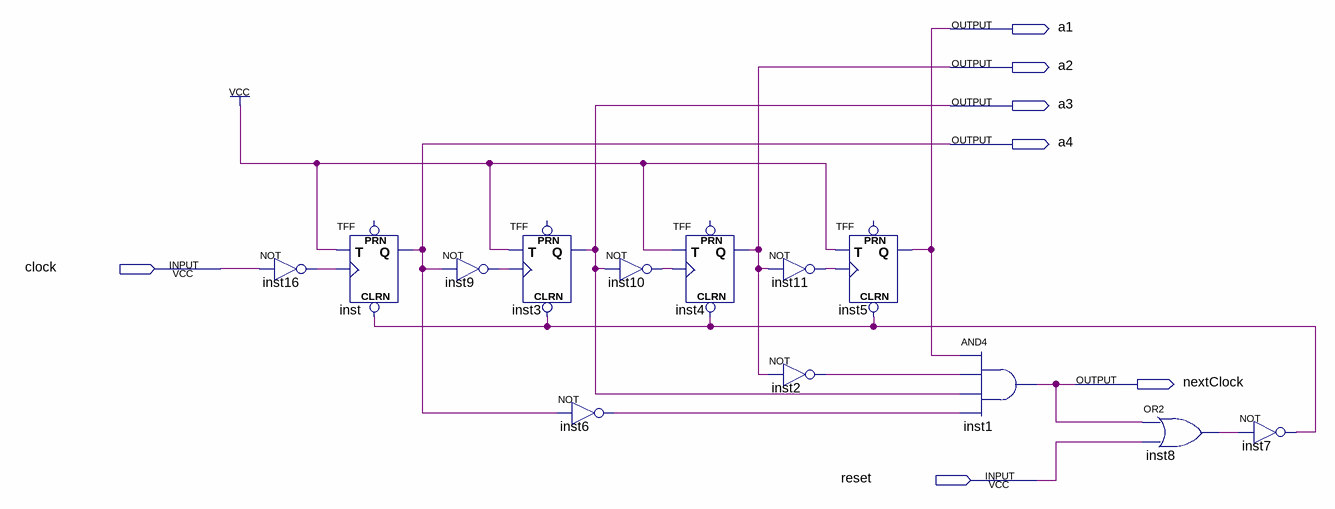
[diagram p0: schematic sheet]
// Quartus schematic OneDigitCounter2.bdf as structural Verilog: 13 symbols, 7 pins
module OneDigitCounter2 (
  input  clock,
  input  reset,
  output a1,
  output a2,
  output a3,
  output a4,
  output nextClock
);

  wire inst2_out, inst6_out, inst7_out, inst8_out, inst9_out, inst10_out, inst11_out, inst16_out;

  not inst16 (inst16_out, clock);
  TFF inst (.CLRN(inst7_out), .T(1'b1), .CLK(inst16_out), .Q(a4));  // open: PRN
  not inst9 (inst9_out, a4);
  TFF inst3 (.CLRN(inst7_out), .T(1'b1), .CLK(inst9_out), .Q(a3));  // open: PRN
  not inst6 (inst6_out, a4);
  not inst10 (inst10_out, a3);
  TFF inst4 (.CLRN(inst7_out), .T(1'b1), .CLK(inst10_out), .Q(a2));  // open: PRN
  not inst11 (inst11_out, a2);
  not inst2 (inst2_out, a2);
  TFF inst5 (.CLRN(inst7_out), .T(1'b1), .CLK(inst11_out), .Q(a1));  // open: PRN
  and inst1 (nextClock, a1, inst2_out, a3, inst6_out);
  or inst8 (inst8_out, nextClock, reset);
  not inst7 (inst7_out, inst8_out);
endmodule
